# Altium schematic sheet SHDN21-S03-V00-DACResistors.SchDoc
size A4
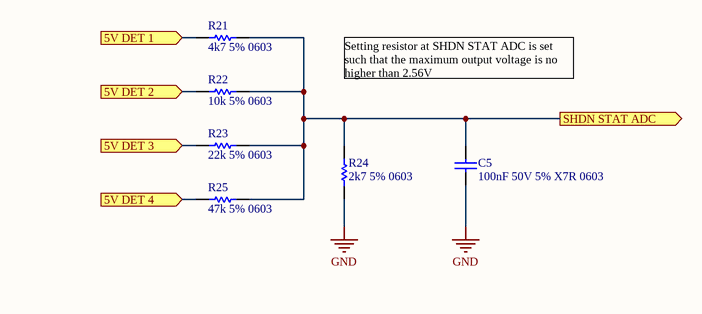
[diagram p0: SHDN21-S03-V00-DACResistors.SchDoc]

## Parts
C5  100nF 50V 5% X7R 0603  [Cap_Ceramic_0603]
R21  4k7 5% 0603  [Res_ThinFilm_0603]
R22  10k 5% 0603  [Res_ThinFilm_0603]
R23  22k 5% 0603  [Res_ThinFilm_0603]
R24  2k7 5% 0603  [Res_ThinFilm_0603]
R25  47k 5% 0603  [Res_ThinFilm_0603]

## Ports
5V DET 1 (in), 5V DET 2 (in), 5V DET 3 (in), 5V DET 4 (in), SHDN STAT ADC (out)

## Nets
GND: C5.1 R24.1
5V DET 1: R21.1 ; port 5V DET 1
5V DET 2: R22.1 ; port 5V DET 2
5V DET 3: R23.1 ; port 5V DET 3
5V DET 4: R25.1 ; port 5V DET 4
SHDN STAT ADC: C5.2 R21.2 R22.2 R23.2 R24.2 R25.2 ; port SHDN STAT ADC

## Notes on the sheet
- Setting resistor at SHDN STAT ADC is set such that the maximum output voltage is no higher than 2.56V

## Library data of the parts
C5 = 100nF 50V 5% X7R 0603: Capacitor, Ceramic, SMD, 100nF, 50V, 5%, X7R, 0603
R21 = 4k7 5% 0603: Resistor, SMD, 4k7, 0.1W, 5%, 0603
R22 = 10k 5% 0603: Resistor, SMD, 10k, 0.1W, 5%, 0603
R23 = 22k 5% 0603: Resistor, SMD, 22k, 0.1W, 5%, 0603
R24 = 2k7 5% 0603: Resistor, SMD, 2k7, 0.1W, 5%, 0603
R25 = 47k 5% 0603: Resistor, SMD, 47k, 0.1W, 5%, 0603